# Altium schematic sheet 02_Project.SchDoc
size A; ApprovedDate: 04/02/2019; AssemblyNumber: ECE315-F19
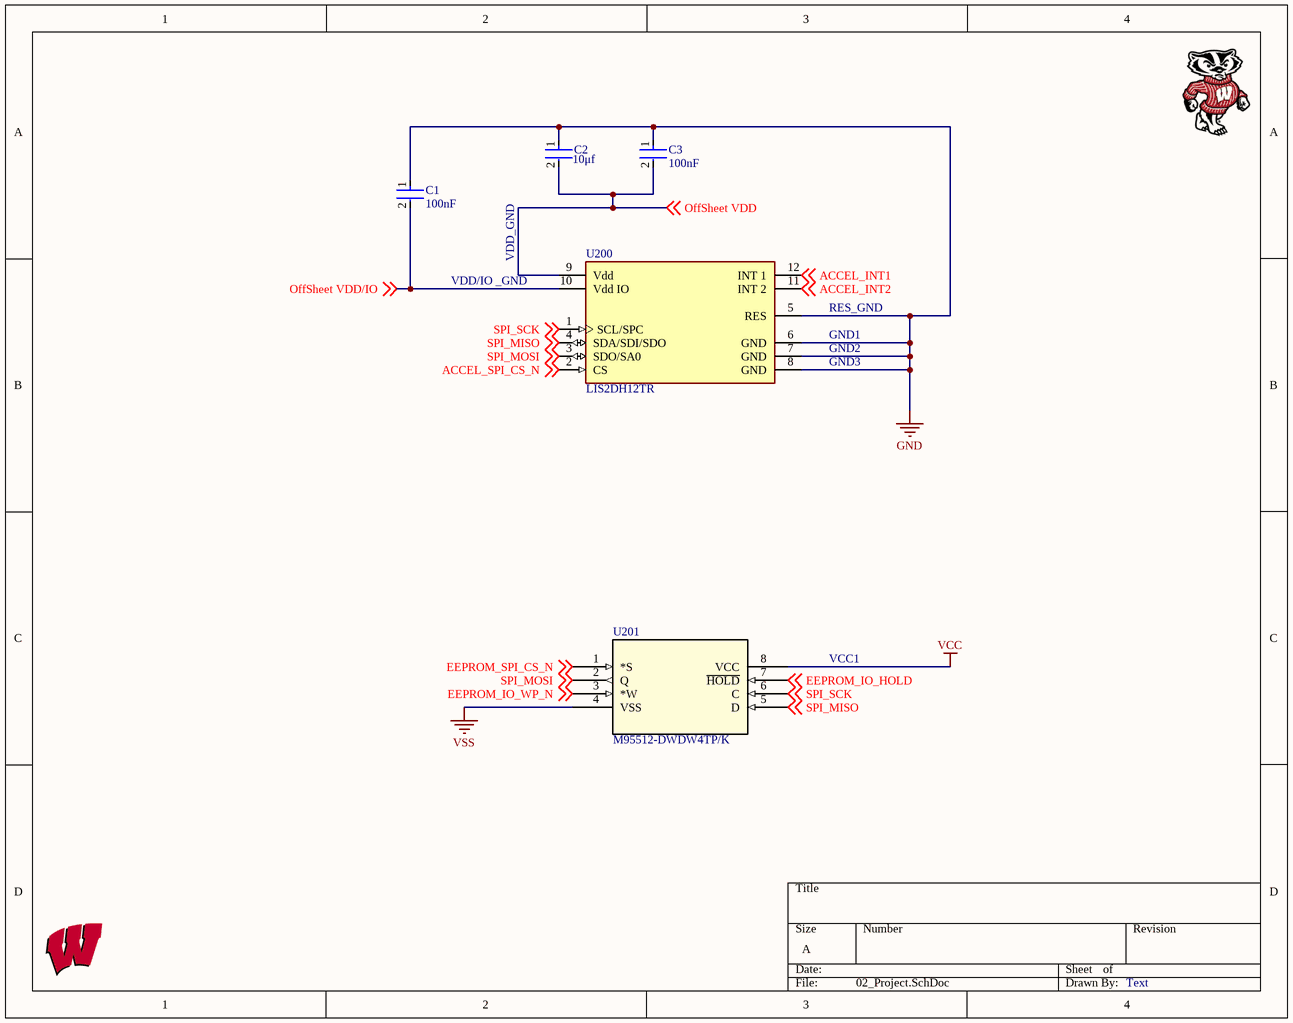
[diagram p0: 02_Project.SchDoc]

## Parts
C1  100nF  [FP-C0805C-DN-MFG]
C2  10μf  [FP-GRM21B-0_15-IPC_C]
C3  100nF  [FP-C0805C-DN-MFG]
U200  LIS2DH12TR  [FP-LGA-12-8365767-MFG]
U201  M95512-DWDW4TP/K  [TSSOP8_169MILS_DW_STM-M]

## Nets
GND: C1.1 C2.1 C3.1 U200.5(RES) U200.6(GND) U200.7(GND) U200.8(GND)
VCC: U201.8(VCC)
VSS: U201.4(VSS)
ACCEL_INT1: U200.12(INT_1) ; off-sheet ACCEL_INT1
ACCEL_INT2: U200.11(INT_2) ; off-sheet ACCEL_INT2
ACCEL_SPI_CS_N: U200.2(CS) ; off-sheet ACCEL_SPI_CS_N
EEPROM_IO_HOLD: U201.7(~{HOLD}) ; off-sheet EEPROM_IO_HOLD
EEPROM_IO_WP_N: U201.3(*W) ; off-sheet EEPROM_IO_WP_N
EEPROM_SPI_CS_N: U201.1(*S) ; off-sheet EEPROM_SPI_CS_N
OffSheet VDD: C2.2 C3.2 U200.9(Vdd) ; off-sheet OffSheet VDD
OffSheet VDD/IO: C1.2 U200.10(Vdd_IO) ; off-sheet OffSheet VDD/IO
SPI_MISO: U200.4(SDA/SDI/SDO) U201.5(D) ; off-sheet SPI_MISO
SPI_MOSI: U200.3(SDO/SA0) U201.2(Q) ; off-sheet SPI_MOSI
SPI_SCK: U200.1(SCL/SPC) U201.6(C) ; off-sheet SPI_SCK

## Notes on the sheet
- VDD/IO _GND
- VDD_GND
- GND1
- GND2
- GND3
- RES_GND
- VCC1
- Text

## Library data of the parts
C1 C3 = CMP-2007-00279-2: CAP CER 0.1UF 50V X7R 0805; Manufacturer Part Number: C0805C104K5RACTU; Manufacturer: KEMET; Value: 0.10 μF; Tolerance: 0.1; Temperature Coefficient: 30ppm/°C; Material: Ceramic; Device Class L2: Capacitors; Temperature Range Low: -55°C; Voltage Rating: 50 V; Digikey Description: CAP CER 0.1UF 50V X7R 0805; Category: Cap; ComponentLink2Description: Datasheet; Octopart: https://octopart.com/c0805c104k5ractu-kemet-143926; RoHS: TRUE; ComponentLink2URL: https://content.kemet.com/datasheets/KEM_C1003_C0G_SMD.pdf; Temperature Characteristic: X7R; Temperature: -55°C to +125°C; Height: 0.88mm; Temperature Range High: +125°C; Device Class L1: Passive Components; Automotive: No; Lead Free: Yes; Ipc Land Pattern Name: CAPC200125X78; Device Class L3: Ceramic Capacitors; Mouser Description: Cap Ceramic 0.1uF 50V X7R 10% SMD 2.0 x 1.2 mm 125 C Paper T/R; Capacitance: 0.10 μF; Package: C0805C-DN
C2 = CMP-2007-03541-2: Chip Multilayer Ceramic Capacitors for General Purpose, 0805, 10uF, X5R, 15%, 10%, 25V; Parameter 1: C1; Length: 2mm; Depth: 1.25mm; Termination: SMD/SMT; Voltage: 25V; Height: 1.25mm; Material: Ceramic; Thickness: 0.053inch; Radiation Hardening: No; Min Operating Temperature: -55°C; Width: 0.049inch; Package Quantity: 1; Mount: Surface Mount; Dielectric: X5R; Packaging: Tape and Reel; Capacitance: 10uF; Voltage Rating (DC): 25V; Lead Free: Lead Free; Max Operating Temperature: 85°C; Case Code (Imperial): 0805; Case/Package: 0805; Tolerance: 10%; Voltage Rating: 25V; Case Code (Metric): 2012
U200 = CMP-2000-05369-2: ACCEL 2-16G I2C/SPI 12LGA; Manufacturer 1: STMicroelectronics; Output Type: SPI; Axis: X, Y, Z; Interface: I2C; Max Supply Voltage: 3.6V; Bandwidth: 672Hz; Min Supply Voltage: 1.71V; Min Operating Temperature: -40°C; Width: 2.15mm; Lead Free: Lead Free; Case/Package: LGA; Contact Plating: Gold; Number of Pins: 12; Max Operating Temperature: 85°C; Packaging: Cut Tape; Radiation Hardening: No; Length: 2.15mm; REACH SVHC: No SVHC; Height: 1mm; Mount: Surface Mount; Supplier 1: Digi-Key; Supplier Part Number 1: 497-14851-1-ND; Manufacturer Part Number 1: LIS2DH12TR; RoHS: Yes; Category: Accelerometers; Stock 1: 3389; Pricing 1: 1=2.11000, 10=1.89800, 25=1.79080, 100=1.52590, 500=1.25364, 1000=1.19394 (USD); Series: -; Reach SVHC Compliant: Yes; RoHS Compliant: Yes; ComponentLink1URL: https://datasheet.ciiva.com/46423/1836729-46423946.pdf?src-supplier=Element14; ComponentLink1Description: https://datasheet.ciiva.com/46423/1836729-46423946.pdf?src-supplier=Element14
U201 = M95512-DWDW4TP/K: EEPROM Serial-SPI 512K-bit 64K x 8 3.3V/5V Automotive 8-Pin TSSOP T/R; Mfr_Name: STMicroelectronics; Interface: SPI,Serial; Access Time: 25ns; Density: 512Kb; Frequency: 10MHz; Min Supply Voltage: 2.5V; Max Supply Voltage: 5.5V; Max Frequency: 16MHz; Nominal Supply Current: 4mA; Copyright: Copyright (C) 2022 Ultra Librarian. All rights reserved.; Manufacturer_Part_Number: M95512-DWDW4TP/K; RefDes: RefDes; Type: DEV; Supplier 1: Digi-Key; Supplier Part Number 1: 497-14459-1-ND; Manufacturer 1: STMicroelectronics; Manufacturer Part Number 1: M95512-DWDW4TP/K; RoHS: Yes; Category: EEPROM; Stock 1: 11469; Pricing 1: 1=2.30000, 10=2.07100, 25=2.03920, 50=2.03400, 100=1.81740, 250=1.76084 (USD); Mount: Surface Mount; Case/Package: TSSOP; Number of Pins: 8; Min Operating Temperature: -40°C; Max Operating Temperature: 145°C; Packaging: Tape and Reel; Memory Type: EEPROM; Radiation Hardening: No; RoHS Compliant: Yes; ComponentLink1URL: https://datasheet.ciiva.com/29614/dm00046608-29614432.pdf?src-supplier=Digi-Key; ComponentLink1Description: https://datasheet.ciiva.com/29614/dm00046608-29614432.pdf?src-supplier=Digi-Key; ComponentLink2URL: https://datasheet.ciiva.com/48501/dm00046608-48501612.pdf?src-supplier=Avnet; ComponentLink2Description: https://datasheet.ciiva.com/48501/dm00046608-48501612.pdf?src-supplier=Avnet